# Altium schematic sheet EmphaseMainBoard.SchDoc
size A2
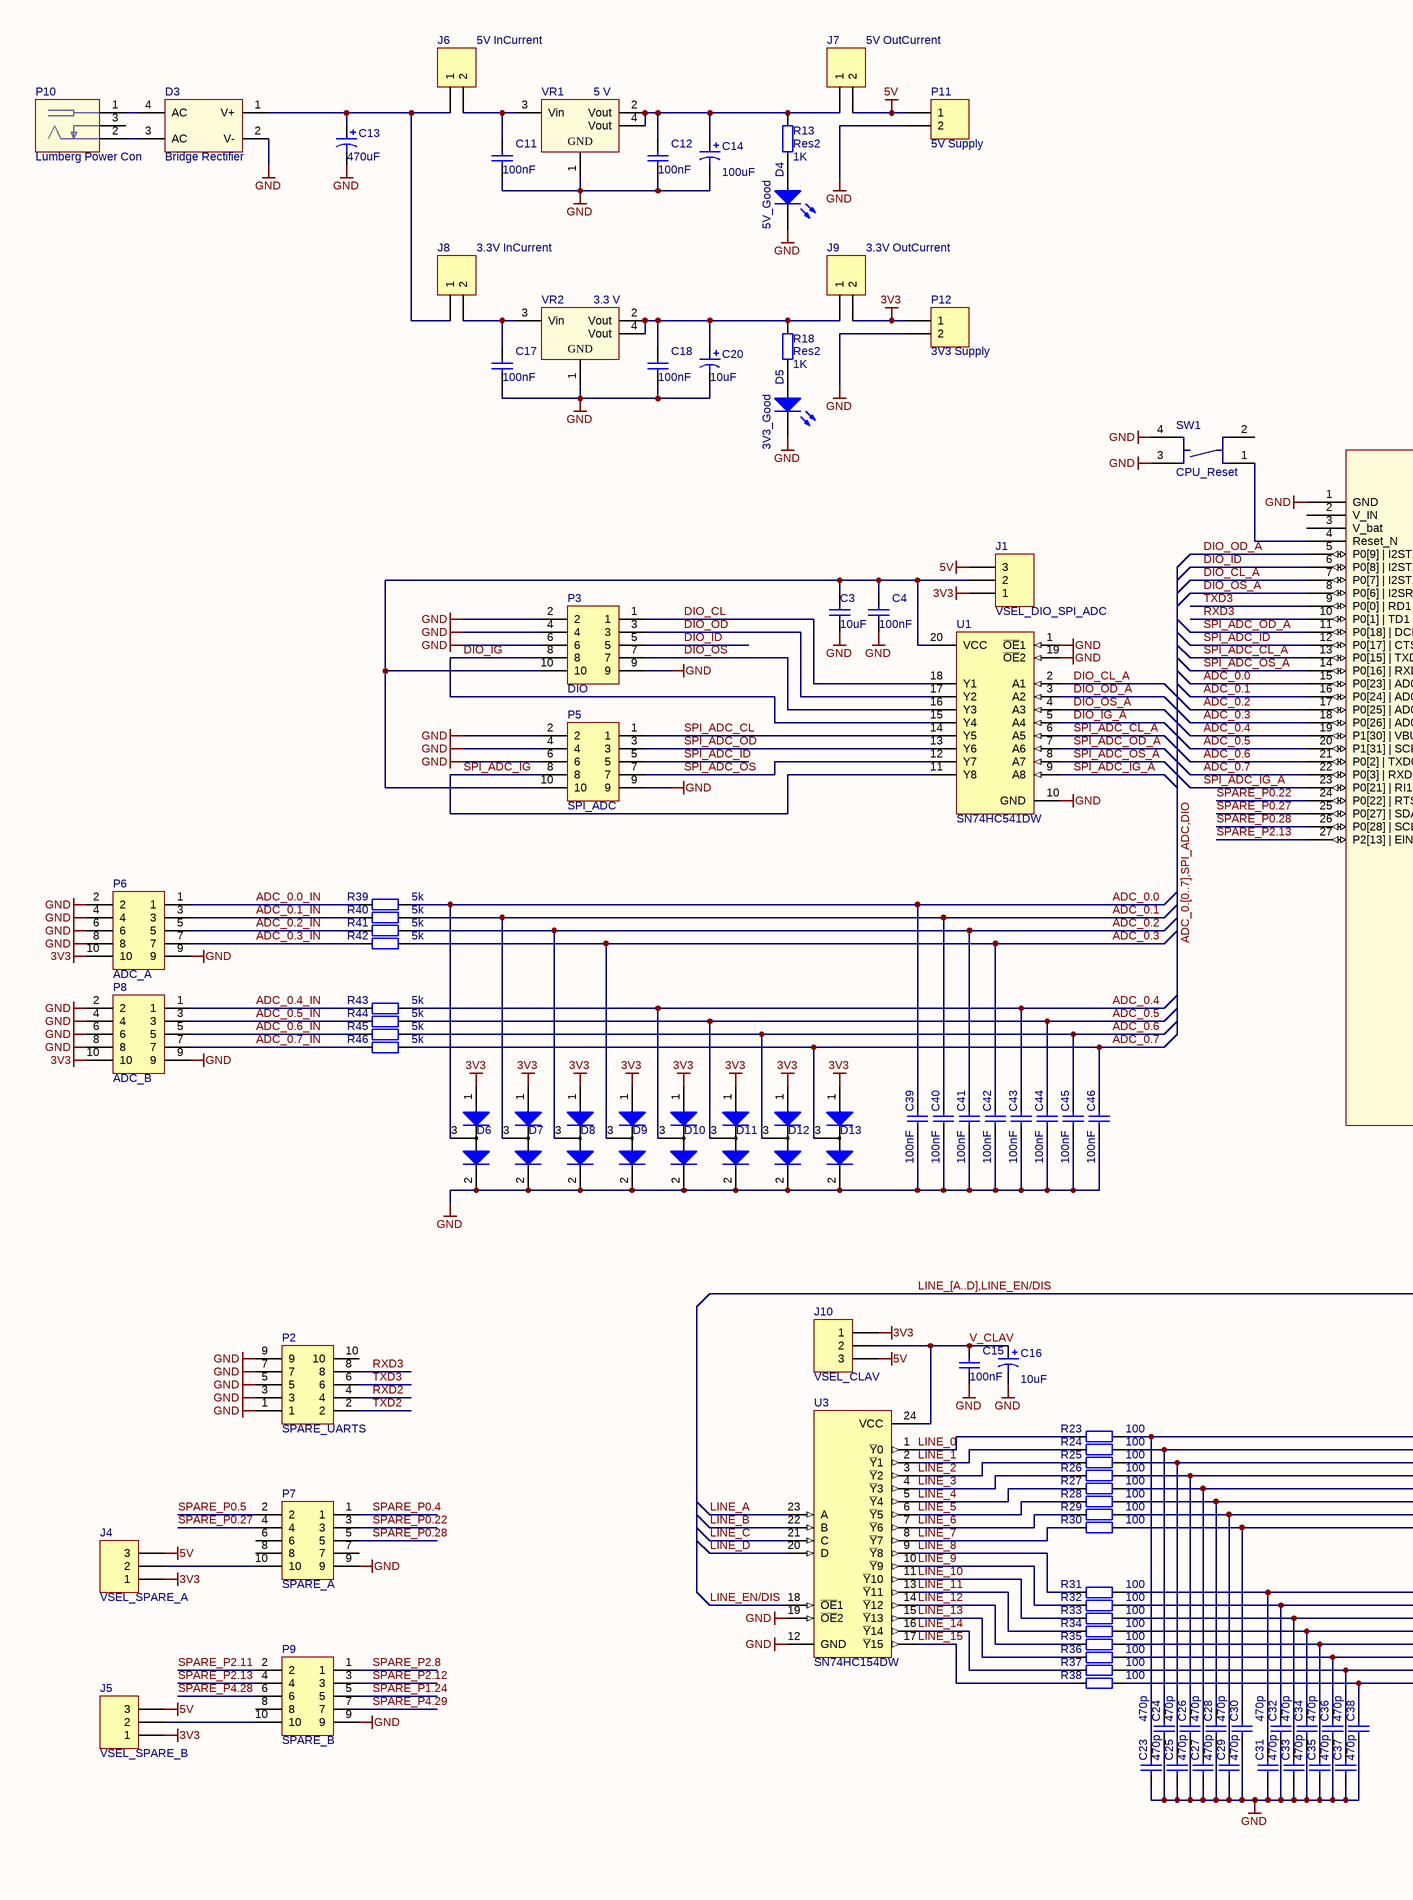
[diagram p0: EmphaseMainBoard.SchDoc, left]
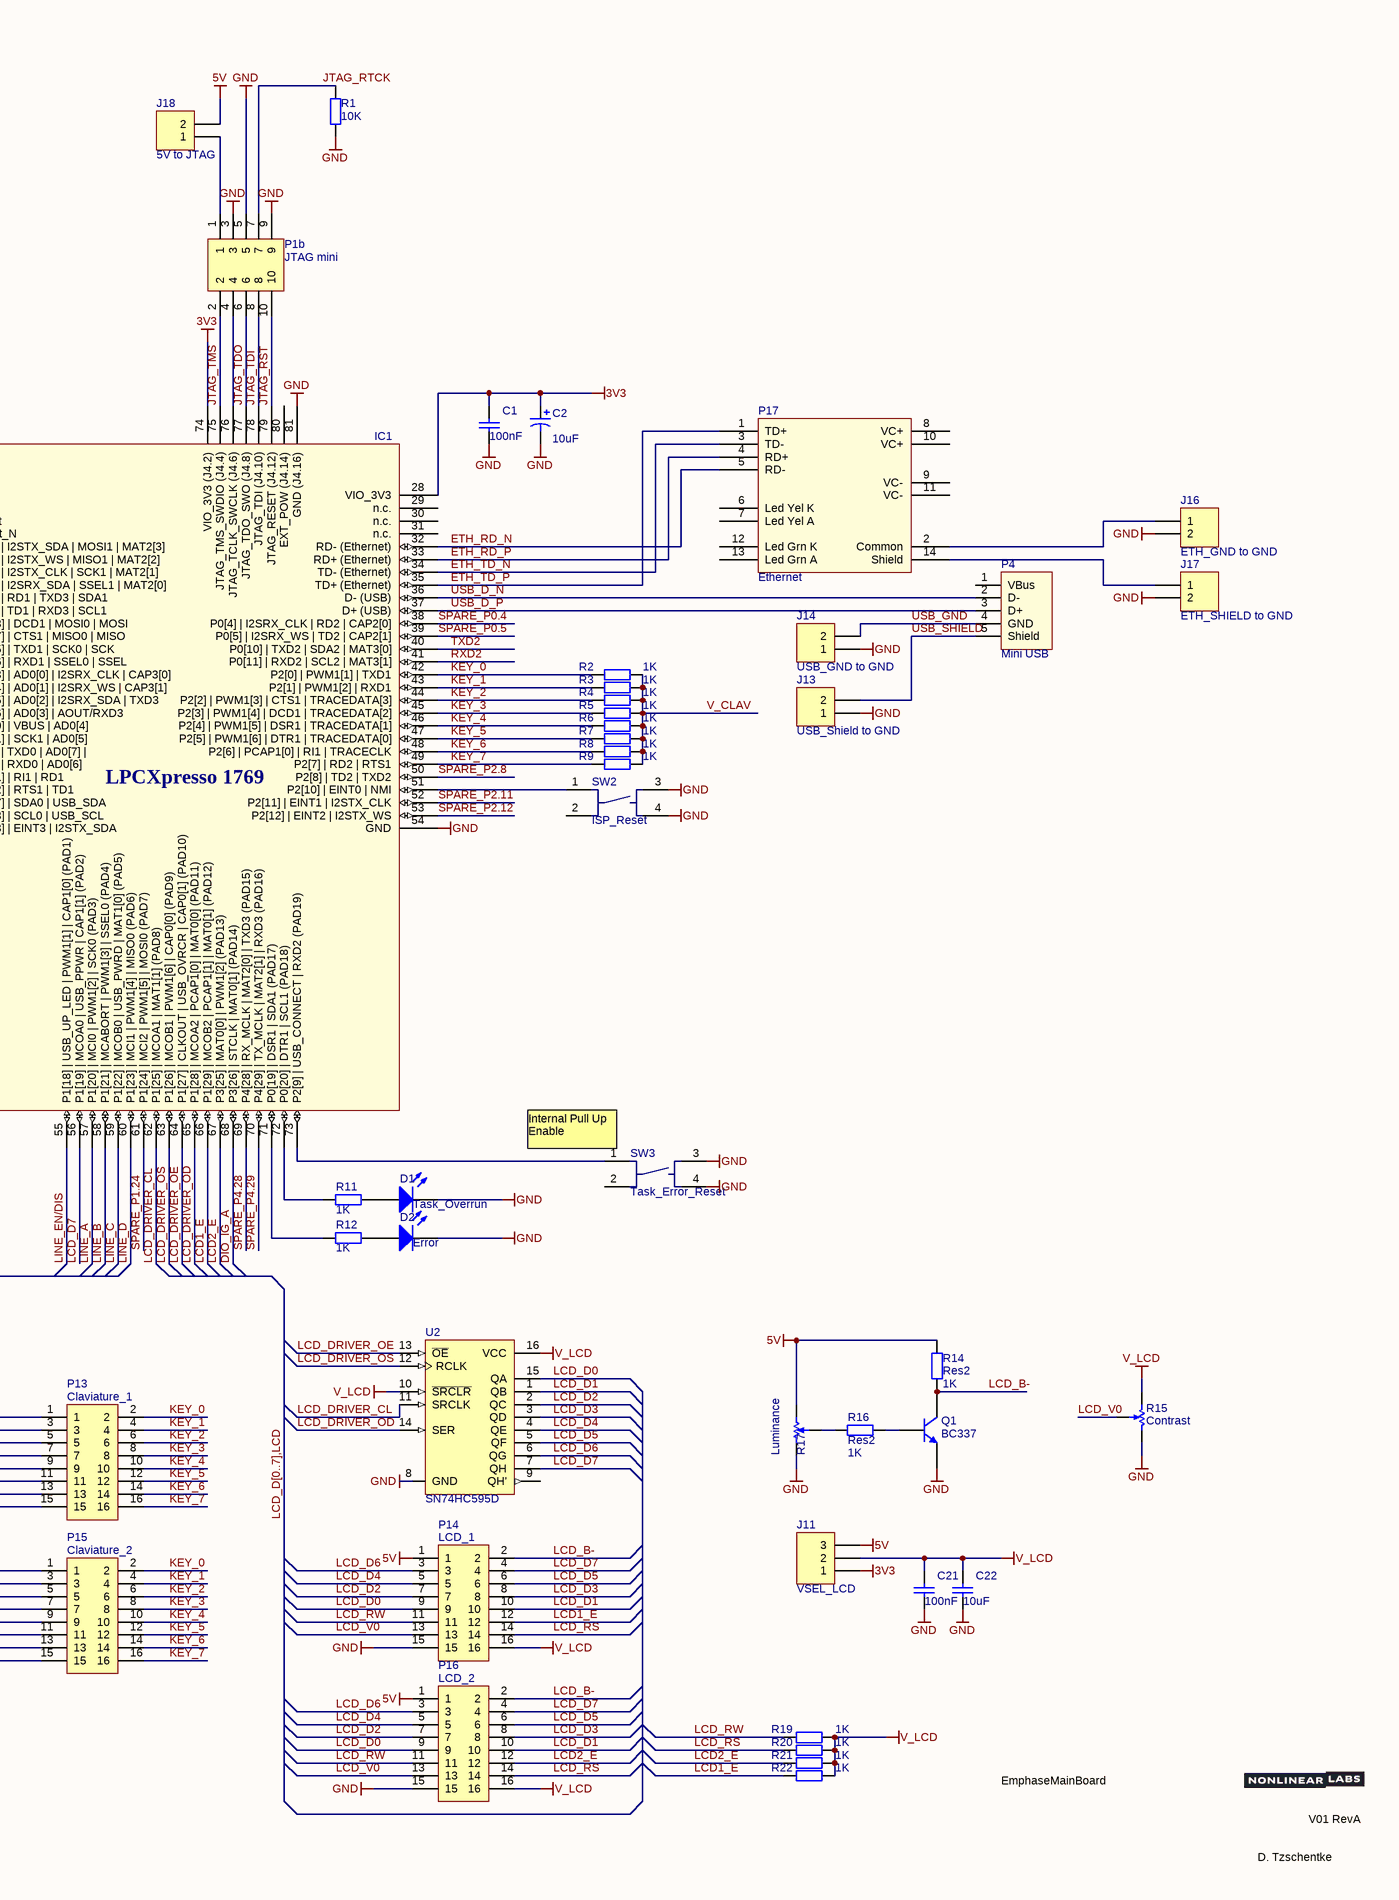
[diagram p1: EmphaseMainBoard.SchDoc, right]

## Parts
C1  value 100nF  [6-0805_N]  (hidden comment: Cap Semi)
C2  value 10uF  [6-0805_N]  (hidden comment: Cap Pol1)
C3  value 10uF  [6-0805_N]  (hidden comment: Cap Semi)
C4  value 100nF  [6-0805_N]  (hidden comment: Cap Semi)
C11  value 100nF  [6-0805_N]  (hidden comment: Cap Semi)
C12  value 100nF  [6-0805_N]  (hidden comment: Cap Semi)
C13  value 470uF  [CAPPR3.5-8x20]  (hidden comment: Cap Pol1)
C14  value 100uF  [CAPPR2.5-6.3x11]  (hidden comment: Cap Pol1)
C15  value 100nF  [6-0805_N]  (hidden comment: Cap Semi)
C16  value 10uF  [6-0805_N]  (hidden comment: Cap Pol1)
C17  value 100nF  [6-0805_N]  (hidden comment: Cap Semi)
C18  value 100nF  [6-0805_N]  (hidden comment: Cap Semi)
C20  value 10uF  [CAPPR2.5-6.3x11]  (hidden comment: Cap Pol1)
C21  value 100nF  [6-0805_N]  (hidden comment: Cap Semi)
C22  value 10uF  [6-0805_N]  (hidden comment: Cap Semi)
C23  value 470p  [6-0805_N]  (hidden comment: Cap Semi)
C24  value 470p  [6-0805_N]  (hidden comment: Cap Semi)
C25  value 470p  [6-0805_N]  (hidden comment: Cap Semi)
C26  value 470p  [6-0805_N]  (hidden comment: Cap Semi)
C27  value 470p  [6-0805_N]  (hidden comment: Cap Semi)
C28  value 470p  [6-0805_N]  (hidden comment: Cap Semi)
C29  value 470p  [6-0805_N]  (hidden comment: Cap Semi)
C30  value 470p  [6-0805_N]  (hidden comment: Cap Semi)
C31  value 470p  [6-0805_N]  (hidden comment: Cap Semi)
C32  value 470p  [6-0805_N]  (hidden comment: Cap Semi)
C33  value 470p  [6-0805_N]  (hidden comment: Cap Semi)
C34  value 470p  [6-0805_N]  (hidden comment: Cap Semi)
C35  value 470p  [6-0805_N]  (hidden comment: Cap Semi)
C36  value 470p  [6-0805_N]  (hidden comment: Cap Semi)
C37  value 470p  [6-0805_N]  (hidden comment: Cap Semi)
C38  value 470p  [6-0805_N]  (hidden comment: Cap Semi)
C39  value 100nF  [6-0805_N]  (hidden comment: Cap Semi)
C40  value 100nF  [6-0805_N]  (hidden comment: Cap Semi)
C41  value 100nF  [6-0805_N]  (hidden comment: Cap Semi)
C42  value 100nF  [6-0805_N]  (hidden comment: Cap Semi)
C43  value 100nF  [6-0805_N]  (hidden comment: Cap Semi)
C44  value 100nF  [6-0805_N]  (hidden comment: Cap Semi)
C45  value 100nF  [6-0805_N]  (hidden comment: Cap Semi)
C46  value 100nF  [6-0805_N]  (hidden comment: Cap Semi)
D1  Task_Overrun  [6-0805_M]
D2  Error  [6-0805_M]
D3  Bridge Rectifier  [SDIP]
D4  5V_Good  [6-0805_M]
D5  3V3_Good  [6-0805_M]
D6  Double Diode  [SOT23-3N]  (value not drawn)
D7  Double Diode  [SOT23-3N]  (value not drawn)
D8  Double Diode  [SOT23-3N]  (value not drawn)
D9  Double Diode  [SOT23-3N]  (value not drawn)
D10  Double Diode  [SOT23-3N]  (value not drawn)
D11  Double Diode  [SOT23-3N]  (value not drawn)
D12  Double Diode  [SOT23-3N]  (value not drawn)
D13  Double Diode  [SOT23-3N]  (value not drawn)
IC1  (no value)  [LPCXpresso1769]
J1  VSEL_DIO_SPI_ADC  [HDR1X3]
J4  VSEL_SPARE_A  [HDR1X3]
J5  VSEL_SPARE_B  [HDR1X3]
J6  5V InCurrent  [HDR1X2]
J7  5V OutCurrent  [HDR1X2]
J8  3.3V InCurrent  [HDR1X2]
J9  3.3V OutCurrent  [HDR1X2]
J10  VSEL_CLAV  [HDR1X3]
J11  VSEL_LCD  [HDR1X3]
J13  USB_Shield to GND  [HDR1X2]
J14  USB_GND to GND  [HDR1X2]
J16  ETH_GND to GND  [HDR1X2]
J17  ETH_SHIELD to GND  [HDR1X2]
J18  5V to JTAG  [HDR1X2]
P1b  JTAG mini  [10 pol Header SMD]
P2  SPARE_UARTS  [10 pol Header]
P3  DIO  [10 pol Header]
P4  Mini USB  [Mini USB Socket - Typ B]
P5  SPI_ADC  [10 pol Header]
P6  ADC_A  [10 pol Header]
P7  SPARE_A  [10 pol Header]
P8  ADC_B  [10 pol Header]
P9  SPARE_B  [10 pol Header]
P10  Lumberg Power Con  [LumbergPowerCon]
P11  5V Supply  [HDR1X2]
P12  3V3 Supply  [HDR1X2]
P13  Claviature_1  [16 pol Header]
P14  LCD_1  [16 pol Header]
P15  Claviature_2  [16 pol Header]
P16  LCD_2  [16 pol Header]
P17  Ethernet  [Ethernet RJ-45]
Q1  BC337  [TO-226-AA]
R1  value 10K  [6-0805]  (hidden comment: Res2)
R2  value 1K  [6-0805]  (hidden comment: Res2)
R3  value 1K  [6-0805]  (hidden comment: Res2)
R4  value 1K  [6-0805]  (hidden comment: Res2)
R5  value 1K  [6-0805]  (hidden comment: Res2)
R6  value 1K  [6-0805]  (hidden comment: Res2)
R7  value 1K  [6-0805]  (hidden comment: Res2)
R8  value 1K  [6-0805]  (hidden comment: Res2)
R9  value 1K  [6-0805]  (hidden comment: Res2)
R11  value 1K  [6-0805]  (hidden comment: Res2)
R12  value 1K  [6-0805]  (hidden comment: Res2)
R13  Res2  value 1K  [6-0805]
R14  Res2  value 1K  [6-0805]
R15  Contrast  [MiniPot]
R16  Res2  value 1K  [6-0805]
R17  Luminance  [MiniPot]
R18  Res2  value 1K  [6-0805]
R19  value 1K  [6-0805]  (hidden comment: Res2)
R20  value 1K  [6-0805]  (hidden comment: Res2)
R21  value 1K  [6-0805]  (hidden comment: Res2)
R22  value 1K  [6-0805]  (hidden comment: Res2)
R23  value 100  [6-0805]  (hidden comment: Res2)
R24  value 100  [6-0805]  (hidden comment: Res2)
R25  value 100  [6-0805]  (hidden comment: Res2)
R26  value 100  [6-0805]  (hidden comment: Res2)
R27  value 100  [6-0805]  (hidden comment: Res2)
R28  value 100  [6-0805]  (hidden comment: Res2)
R29  value 100  [6-0805]  (hidden comment: Res2)
R30  value 100  [6-0805]  (hidden comment: Res2)
R31  value 100  [6-0805]  (hidden comment: Res2)
R32  value 100  [6-0805]  (hidden comment: Res2)
R33  value 100  [6-0805]  (hidden comment: Res2)
R34  value 100  [6-0805]  (hidden comment: Res2)
R35  value 100  [6-0805]  (hidden comment: Res2)
R36  value 100  [6-0805]  (hidden comment: Res2)
R37  value 100  [6-0805]  (hidden comment: Res2)
R38  value 100  [6-0805]  (hidden comment: Res2)
R39  value 5k  [6-0805]  (hidden comment: Res2)
R40  value 5k  [6-0805]  (hidden comment: Res2)
R41  value 5k  [6-0805]  (hidden comment: Res2)
R42  value 5k  [6-0805]  (hidden comment: Res2)
R43  value 5k  [6-0805]  (hidden comment: Res2)
R44  value 5k  [6-0805]  (hidden comment: Res2)
R45  value 5k  [6-0805]  (hidden comment: Res2)
R46  value 5k  [6-0805]  (hidden comment: Res2)
SW1  CPU_Reset  [SMD Switch]
SW2  ISP_Reset  [SMD Switch]
SW3  Task_Error_Reset  [SMD Switch]
U1  SN74HC541DW  [DW020_N]
U2  SN74HC595D  [D016_M]
U3  SN74HC154DW  [SOIC127P1199-24AN]
VR1  5 V  [SOT223-4N]
VR2  3.3 V  [SOT223-4N]

## Nets
3V3: C1.2 C2.1 D6.1 D7.1 D8.1 D9.1 D10.1 D11.1 D12.1 D13.1 IC1.28(VIO_3V3) IC1.74(VIO_3V3_(J4.2)) J1.1 J4.1 J5.1 J9.2 J10.1 J11.1 P6.10 P8.10 P12.1
5V: J1.3 J4.3 J5.3 J7.2 J10.3 J11.3 J18.2 P11.1 P14.1 P16.1 R14.2 R17.CW(+)
GND: C1.1 C2.2 C3.1 C4.1 C11.1 C12.1 C13.2 C14.2 C15.1 C16.2 C17.1 C18.1 C20.2 C21.1 C22.1 C23.1 C24.1 C25.1 C26.1 C27.1 C28.1 C29.1 C30.1 C31.1 C32.1 C33.1 C34.1 C35.1 C36.1 C37.1 C38.1 C39.1 C40.1 C41.1 C42.1 C43.1 C44.1 C45.1 C46.1 D1.2(K) D2.2(K) D3.2(V-) D4.2(K) D5.2(K) D6.2 D7.2 D8.2 D9.2 D10.2 D11.2 D12.2 D13.2 IC1.1(GND) IC1.54(GND) IC1.81(GND_(J4.16)) J13.1 J14.1 J16.2 J17.2 P1b.3 P1b.5 P1b.9 P2.1 P2.3 P2.5 P2.7 P2.9 P3.2 P3.4 P3.6 P3.9 P5.2 P5.4 P5.6 P5.9 P6.2 P6.4 P6.6 P6.8 P6.9 P7.9 P8.2 P8.4 P8.6 P8.8 P8.9 P9.9 P11.2 P12.2 P14.15 P16.15 Q1.3(E) R1.2 R15.CCW(-) R17.CCW(-) SW1.3 SW1.4 SW2.3 SW2.4 SW3.3 SW3.4 U1.1(~{OE}1) U1.10(GND) U1.19(~{OE}2) U2.8(GND) U3.12(GND) U3.19(~{OE}2) VR1.1(GND) VR2.1(GND)
V_LCD: C21.2 C22.2 J11.2 P14.16 P16.16 R15.CW(+) R19.1 R20.1 R21.1 R22.1 U2.10(~{SRCLR}) U2.16(VCC)
ADC_0.0: C39.2 D6.3 IC1.15(P0[23]_|_AD0[0]_|_I2SRX_CLK_|_CAP3[0]) R39.1
ADC_0.0_IN: P6.1 R39.2
ADC_0.1: C40.2 D7.3 IC1.16(P0[24]_|_AD0[1]_|_I2SRX_WS_|_CAP3[1]) R40.1
ADC_0.1_IN: P6.3 R40.2
ADC_0.2: C41.2 D8.3 IC1.17(P0[25]_|_AD0[2]_|_I2SRX_SDA_|_TXD3) R41.1
ADC_0.2_IN: P6.5 R41.2
ADC_0.3: C42.2 D9.3 IC1.18(P0[26]_|_AD0[3]_|_AOUT/RXD3) R42.1
ADC_0.3_IN: P6.7 R42.2
ADC_0.4: C43.2 D10.3 IC1.19(P1[30]_|_VBUS_|_AD0[4]) R43.1
ADC_0.4_IN: P8.1 R43.2
ADC_0.5: C44.2 D11.3 IC1.20(P1[31]_|_SCK1_|_AD0[5]) R44.1
ADC_0.5_IN: P8.3 R44.2
ADC_0.6: C45.2 D12.3 IC1.21(P0[2]_|_TXD0_|_AD0[7]_|) R45.1
ADC_0.6_IN: P8.5 R45.2
ADC_0.7: C46.2 D13.3 IC1.22(P0[3]_|_RXD0_|_AD0[6]) R46.1
ADC_0.7_IN: P8.7 R46.2
DIO_CL: P3.1 U1.18(Y1)
DIO_CL_A: IC1.7(P0[7]_|_I2STX_CLK_|_SCK1_|_MAT2[1]) U1.2(A1)
DIO_ID: IC1.6(P0[8]_|_I2STX_WS_|_MISO1_|_MAT2[2]) P3.5
DIO_IG: P3.8 U1.15(Y4)
DIO_IG_A: IC1.68(P3[26]_|_STCLK_|_MAT0[1]_(PAD14)) U1.5(A4)
DIO_OD: P3.3 U1.17(Y2)
DIO_OD_A: IC1.5(P0[9]_|_I2STX_SDA_|_MOSI1_|_MAT2[3]) U1.3(A2)
DIO_OS: P3.7 U1.16(Y3)
DIO_OS_A: IC1.8(P0[6]_|_I2SRX_SDA_|_SSEL1_|_MAT2[0]) U1.4(A3)
ETH_RD_N: IC1.32(RD-_(Ethernet)) P17.5(RD-)
ETH_RD_P: IC1.33(RD+_(Ethernet)) P17.4(RD+)
ETH_TD_N: IC1.34(TD-_(Ethernet)) P17.3(TD-)
ETH_TD_P: IC1.35(TD+_(Ethernet)) P17.1(TD+)
JTAG_RST: IC1.79(JTAG_RESET_(J4.12)) P1b.10
JTAG_RTCK: P1b.7 R1.1
JTAG_TDI: IC1.78(JTAG_TDI_(J4.10)) P1b.8
JTAG_TDO: IC1.77(JTAG_TDO_SWO_(J4.8)) P1b.6
JTAG_TMS: IC1.75(JTAG_TMS_SWDIO_(J4.4)) P1b.2
KEY_0: IC1.42(P2[0]_|_PWM1[1]_|_TXD1) P13.2 P15.2 R2.2
KEY_1: IC1.43(P2[1]_|_PWM1[2]_|_RXD1) P13.4 P15.4 R3.2
KEY_2: IC1.44(P2[2]_|_PWM1[3]_|_CTS1_|_TRACEDATA[3]) P13.6 P15.6 R4.2
KEY_3: IC1.45(P2[3]_|_PWM1[4]_|_DCD1_|_TRACEDATA[2]) P13.8 P15.8 R5.2
KEY_4: IC1.46(P2[4]_|_PWM1[5]_|_DSR1_|_TRACEDATA[1]) P13.10 P15.10 R6.2
KEY_5: IC1.47(P2[5]_|_PWM1[6]_|_DTR1_|_TRACEDATA[0]) P13.12 P15.12 R8.2
KEY_6: IC1.48(P2[6]_|_PCAP1[0]_|_RI1_|_TRACECLK) P13.14 P15.14 R7.2
KEY_7: IC1.49(P2[7]_|_RD2_|_RTS1) P13.16 P15.16 R9.2
LCD1_E: IC1.66(P1[29]_|_MCOB2_|_PCAP1[1]_|_MAT0[1]_(PAD12)) P14.12 R22.2
LCD2_E: IC1.67(P3[25]_|_MAT0[0]_|_PWM1[2]_(PAD13)) P16.12 R21.2
LCD_B-: P14.2 P16.2 Q1.1(C) R14.1
LCD_D0: P14.9 P16.9 U2.15(QA)
LCD_D1: P14.10 P16.10 U2.1(QB)
LCD_D2: P14.7 P16.7 U2.2(QC)
LCD_D3: P14.8 P16.8 U2.3(QD)
LCD_D4: P14.5 P16.5 U2.4(QE)
LCD_D5: P14.6 P16.6 U2.5(QF)
LCD_D6: P14.3 P16.3 U2.6(QG)
LCD_D7: IC1.56(P1[19]_|_MCOA0_|_USB_PPWR_|_CAP1[1]_(PAD2)) P14.4 P16.4 U2.7(QH)
LCD_DRIVER_CL: IC1.62(P1[25]_|_MCOA1_|_MAT1[1]_(PAD8)) U2.11(SRCLK)
LCD_DRIVER_OD: IC1.65(P1[28]_|_MCOA2_|_PCAP1[0]_|_MAT0[0]_(PAD11)) U2.14(SER)
LCD_DRIVER_OE: IC1.64(P1[27]_|_CLKOUT_|_USB_OVRCR_|_CAP0[1]_(PAD10)) U2.13(~{OE})
LCD_DRIVER_OS: IC1.63(P1[26]_|_MCOB1_|_PWM1[6]_|_CAP0[0]_(PAD9)) U2.12(RCLK)
LCD_RS: P14.14 P16.14 R20.2
LCD_RW: P14.11 P16.11 R19.2
LCD_V0: P14.13 P16.13 R15.W
LINE_0: R23.2 U3.1(~{Y}0)
LINE_1: R24.2 U3.2(~{Y}1)
LINE_2: R25.2 U3.3(~{Y}2)
LINE_3: R26.2 U3.4(~{Y}3)
LINE_4: R27.2 U3.5(~{Y}4)
LINE_5: R28.2 U3.6(~{Y}5)
LINE_6: R29.2 U3.7(~{Y}6)
LINE_7: R30.2 U3.8(~{Y}7)
LINE_8: R31.2 U3.9(~{Y}8)
LINE_9: R32.2 U3.10(~{Y}9)
LINE_10: R33.2 U3.11(~{Y}10)
LINE_11: R34.2 U3.13(~{Y}11)
LINE_12: R35.2 U3.14(~{Y}12)
LINE_13: R36.2 U3.15(~{Y}13)
LINE_14: R37.2 U3.16(~{Y}14)
LINE_15: R38.2 U3.17(~{Y}15)
LINE_A: IC1.57(P1[20]_|_MCI0_|_PWM1[2]_|_SCK0_(PAD3)) U3.23(A)
LINE_B: IC1.58(P1[21]_|_MCABORT_|_PWM1[3]_|_SSEL0_(PAD4)) U3.22(B)
LINE_C: IC1.59(P1[22]_|_MCOB0_|_USB_PWRD_|_MAT1[0]_(PAD5)) U3.21(C)
LINE_D: IC1.60(P1[23]_|_MCI1_|_PWM1[4]_|_MISO0_(PAD6)) U3.20(D)
LINE_EN/DIS: IC1.55(P1[18]_|_USB_UP_LED_|_PWM1[1]_|_CAP1[0]_(PAD1)) U3.18(~{OE}1)
RXD2: IC1.41(P0[11]_|_RXD2_|_SCL2_|_MAT3[1]) P2.4
RXD3: IC1.10(P0[1]_|_TD1_|_RXD3_|_SCL1) P2.8
SPARE_P0.4: IC1.38(P0[4]_|_I2SRX_CLK_|_RD2_|_CAP2[0]) P7.1
SPARE_P0.5: IC1.39(P0[5]_|_I2SRX_WS_|_TD2_|_CAP2[1]) P7.2
SPARE_P0.22: IC1.24(P0[22]_|_RTS1_|_TD1) P7.3
SPARE_P0.27: IC1.25(P0[27]_|_SDA0_|_USB_SDA) P7.4
SPARE_P0.28: IC1.26(P0[28]_|_SCL0_|_USB_SCL) P7.5
SPARE_P1.24: IC1.61(P1[24]_|_MCI2_|_PWM1[5]_|_MOSI0_(PAD7)) P9.5
SPARE_P2.8: IC1.50(P2[8]_|_TD2_|_TXD2) P9.1
SPARE_P2.11: IC1.52(P2[11]_|_EINT1_|_I2STX_CLK) P9.2
SPARE_P2.12: IC1.53(P2[12]_|_EINT2_|_I2STX_WS) P9.3
SPARE_P2.13: IC1.27(P2[13]_|_EINT3_|_I2STX_SDA) P9.4
SPARE_P4.28: IC1.69(P4[28]_|_RX_MCLK_|_MAT2[0]_|_TXD3_(PAD15)) P9.6
SPARE_P4.29: IC1.70(P4[29]_|_TX_MCLK_|_MAT2[1]_|_RXD3_(PAD16)) P9.7
SPI_ADC_CL: P5.1 U1.14(Y5)
SPI_ADC_CL_A: IC1.13(P0[15]_|_TXD1_|_SCK0_|_SCK) U1.6(A5)
SPI_ADC_ID: IC1.12(P0[17]_|_CTS1_|_MISO0_|_MISO) P5.5
SPI_ADC_IG: P5.8 U1.11(Y8)
SPI_ADC_IG_A: IC1.23(P0[21]_|_RI1_|_RD1) U1.9(A8)
SPI_ADC_OD: P5.3 U1.13(Y6)
SPI_ADC_OD_A: IC1.11(P0[18]_|_DCD1_|_MOSI0_|_MOSI) U1.7(A6)
SPI_ADC_OS: P5.7 U1.12(Y7)
SPI_ADC_OS_A: IC1.14(P0[16]_|_RXD1_|_SSEL0_|_SSEL) U1.8(A7)
TXD2: IC1.40(P0[10]_|_TXD2_|_SDA2_|_MAT3[0]) P2.2
TXD3: IC1.9(P0[0]_|_RD1_|_TXD3_|_SDA1) P2.6
USB_D_N: IC1.36(D-_(USB)) P4.2(D-)
USB_D_P: IC1.37(D+_(USB)) P4.3(D+)
USB_GND: J14.2 P4.4(GND)
USB_SHIELD: J13.2 P4.5(Shield)
V_CLAV: C15.2 C16.1 J10.2 R2.1 R3.1 R4.1 R5.1 R6.1 R7.1 R8.1 R9.1 U3.24(VCC)
NetC3_2: C3.2 C4.2 J1.2 P3.10 P5.10 U1.20(VCC)
NetC11_2: C11.2 J6.2 VR1.3(Vin)
NetC12_2: C12.2 C14.1 J7.1 R13.2 VR1.2(Vout) VR1.4(Vout)
NetC13_1: C13.1 D3.1(V+) J6.1 J8.1
NetC17_2: C17.2 J8.2 VR2.3(Vin)
NetC18_2: C18.2 C20.1 J9.1 R18.2 VR2.2(Vout) VR2.4(Vout)
NetC23_2: C23.2 P13.1 R23.1
NetC24_2: C24.2 P13.3 R24.1
NetC25_2: C25.2 P13.5 R25.1
NetC26_2: C26.2 P13.7 R26.1
NetC27_2: C27.2 P13.9 R27.1
NetC28_2: C28.2 P13.11 R28.1
NetC29_2: C29.2 P13.13 R29.1
NetC30_2: C30.2 P13.15 R30.1
NetC31_2: C31.2 P15.1 R31.1
NetC32_2: C32.2 P15.3 R32.1
NetC33_2: C33.2 P15.5 R33.1
NetC34_2: C34.2 P15.7 R34.1
NetC35_2: C35.2 P15.9 R35.1
NetC36_2: C36.2 P15.11 R36.1
NetC37_2: C37.2 P15.13 R37.1
NetC38_2: C38.2 P15.15 R38.1
NetD1_1: D1.1(A) R11.1
NetD2_1: D2.1(A) R12.1
NetD3_3: D3.3(AC) P10.2
NetD3_4: D3.4(AC) P10.1
NetD4_1: D4.1(A) R13.1
NetD5_1: D5.1(A) R18.1
NetIC1_4: IC1.4(Reset_N) SW1.1
NetIC1_51: IC1.51(P2[10]_|_EINT0_|_NMI) SW2.1
NetIC1_71: IC1.71(P0[19]_|_DSR1_|_SDA1_(PAD17)) R12.2
NetIC1_72: IC1.72(P0[20]_|_DTR1_|_SCL1_(PAD18)) R11.2
NetIC1_73: IC1.73(P2[9]_|_USB_CONNECT_|_RXD2_(PAD19)) SW3.1
NetIC1_76: IC1.76(JTAG_TCLK_SWCLK_(J4.6)) P1b.4
NetJ4_2: J4.2 P7.10
NetJ5_2: J5.2 P9.10
NetJ16_1: J16.1 P17.2(Common)
NetJ17_1: J17.1 P17.14(Shield)
NetJ18_1: J18.1 P1b.1
NetQ1_2: Q1.2(B) R16.2
NetR16_1: R16.1 R17.W

Not connected (* = marked no-connect by the designer): IC1 2(V_IN) 3(V_bat) 29(n.c.) 30(n.c.) 31(n.c.) 80(EXT_POW_(J4.14)); P2 10; P4 1(VBus); P7 6 7 8; P9 8; P10 3; P17 6(Led_Yel_K) 7(Led_Yel_A) 8(VC+) 9(VC-) 10(VC+) 11(VC-) 12(Led_Grn_K) 13(Led_Grn_A); SW1 2; SW2 2; SW3 2; U2 9(QH')

## Buses and harness runs
bus ADC_0.[0..7],SPI_ADC,DIO
bus LCD_D[0..7],LCD
bus LINE_[A..D],LINE_EN/DIS

## Notes on the sheet
- (near SW3) Internal Pull Up Enable
- EmphaseMainBoard
- D. Tzschentke
- V01 RevA
- (in symbol Component_1) LPCXpresso 1769

## Library data of the parts
C1 C3 C4 C11 C12 C15 C17 C18 C21-C46 = Cap Semi: Capacitor (Semiconductor SIM Model); Published: 8-Jun-2000; LatestRevisionDate: 29-May-2009; LatestRevisionNote: IPC-7351 Footprint Added.; PackageReference: C1206; Publisher: Altium Limited; PackageDescription: Chip Capacitor
C2 C13 C14 C16 C20 = Cap Pol1: Polarized Capacitor (Radial); Published: 8-Jun-2000; LatestRevisionDate: 17-Jul-2002; LatestRevisionNote: Re-released for DXP Platform.; PackageReference: RB7.6-15; Publisher: Altium Limited; PackageDescription: Polarized Capacitor (Radial); 2 Leads
D1 D2 D4 D5 = LED3: Typical BLUE SiC LED; Published: 8-Jun-2000; LatestRevisionDate: 17-Dec-2003; LatestRevisionNote: PCB Footprint replaced.; DatasheetVersion: 16-Apr-2002; PackageVersion: 16-Apr-2002; PackageReference: 3.5X2.8X1.9; Publisher: Altium Limited; PackageDescription: SM LED; 2 C-Bend Leads; Body 3.5 x 2.8 x 1.9 mm, inc leads (LxWxH typ)
D3 = Bridge Rectifiers: Published: 2012-06-19; Publisher: NONLINEAR LABS
D6-D13 = Double Diode: High Speed Double Diode; Publisher: NONLINEAR LABS
IC1 = Component_1: Capacitor (Semiconductor SIM Model)
J1 J4 J5 J10 J11 = Header 3: Header, 3-Pin; LatestRevisionDate: 17-Jul-2002; LatestRevisionNote: Re-released for DXP Platform.; Publisher: Altium Limited
J6-J9 J13 J14 J16-J18 P11 P12 = Header 2: Header, 2-Pin; LatestRevisionDate: 17-Jul-2002; LatestRevisionNote: Re-released for DXP Platform.; Publisher: Altium Limited
P1b = 10 pol Header: JTAG; LatestRevisionDate: 2012-06-14; Publisher: NONLINEAR LABS
P2 P3 P5-P9 = 10 pol Header: LatestRevisionDate: 2012-06-14; Publisher: NONLINEAR LABS
P4 = Mini USB Jack B: Publisher: NONLINEAR LABS
P10 = Lumberg Power Connector: Published: 2012-06-19; Publisher: NONLINEAR LABS
P13-P16 = 16 pol Header: LatestRevisionDate: 2012-06-14; Publisher: NONLINEAR LABS
P17 = Ethernet Jack: Bel Stewart - MagJack 10/100 RJ-45 Ethernet; LatestRevisionDate: 2012-06-26; Publisher: NONLINEAR LABS
Q1 = NPN: NPN Bipolar Transistor; Published: 8-Jun-2000; LatestRevisionDate: 17-Jul-2002; LatestRevisionNote: Re-released for DXP Platform.; PackageReference: TO-226-AA; Publisher: Altium Limited; PackageDescription: TO, Flat Index; 3 In-Line, Axial Leads; Body Dia. 4.8mm; Leads 0.55 x 0.51 mm (max); Code_JEDEC: TO-226-AA
R1-R9 R11-R14 R16 R18-R46 = Res2: Resistor; Published: 8-Jun-2000; LatestRevisionDate: 17-Jul-2002; LatestRevisionNote: Re-released for DXP Platform.; PackageReference: AXIAL-0.4; Publisher: Altium Limited; PackageDescription: Axial Device, Thru-Hole; 2 Leads; 0.4 in Pin Spacing
R15 R17 = RPot SM: Square Trimming Potentiometer; Published: 17-Dec-2003; DatasheetVersion: Oct-2003; PackageReference: POT4MM-2; Publisher: Altium Limited; PackageDescription: Square Trimming Potentiometer; ComponentLink1Description: Manufacturer Link; ComponentLink1URL: http://bourns.com/2/search.html
SW1-SW3 = Generic SMD Switch: Published: 2012-06-19; Publisher: NONLINEAR LABS
U1 = SN74HC541DW: Octal Buffer/Driver with 3-State Outputs; Published: 8-Jun-2000; LatestRevisionDate: 13-Apr-2006; LatestRevisionNote: IPC-7351 Footprint Added.; DatasheetVersion: May-1997; PackageVersion: Mar-2000; PackageReference: DW020; Publisher: Altium Limited; PackageDescription: 20-Pin Plastic Small Outline Integrated Circuit 1.27 mm Pitch; Code_JEDEC: MS-013; Code_IPC: SOIC127P1030-20; ComponentLink1Description: Manufacturer Link; ComponentLink1URL: http://www.ti.com/; ComponentLink2Description: Datasheet; ComponentLink2URL: http://www-s.ti.com/sc/ds/sn74hc541.pdf
U2 = SN74HC595D: 8-Bit Shift Register with 3-State Output Registers; Published: 8-Jun-2000; LatestRevisionDate: 13-Apr-2006; LatestRevisionNote: IPC-7351 Footprint Added.; DatasheetVersion: May-1997; PackageVersion: Jan-1998; PackageReference: D016; Publisher: Altium Limited; PackageDescription: 16-Pin Small Outline Integrated Circuit 1.27 mm Pitch; Code_IPC: SOIC127P600-16; ComponentLink1Description: Manufacturer Link; ComponentLink1URL: http://www.ti.com/; ComponentLink2Description: Datasheet; ComponentLink2URL: http://www-s.ti.com/sc/ds/sn74hc595.pdf
U3 = SN74HC154DW: 4-Line to 16-Line Decoder / Demultiplexer; ComponentAvailability: Obsolete; Published: 8-Jun-2000; LatestRevisionDate: 13-Apr-2006; LatestRevisionNote: IPC-7351 Footprint Added.; DatasheetVersion: Sep-1987; PackageVersion: Mar-2000; PackageReference: DW024; Publisher: Altium Limited; PackageDescription: 24-Pin Plastic Small Outline Integrated Circuit 1.27 mm Pitch; Code_JEDEC: MS-013; ComponentLink1Description: Manufacturer Link; ComponentLink1URL: http://www.ti.com/; ComponentLink2Description: Discontinuation Notice; ComponentLink2URL: http://focus.ti.com/docs/prod/folders/print/sn74hc154.html
VR1 VR2 = Voltage Regulator: Publisher: NONLINEAR LABS